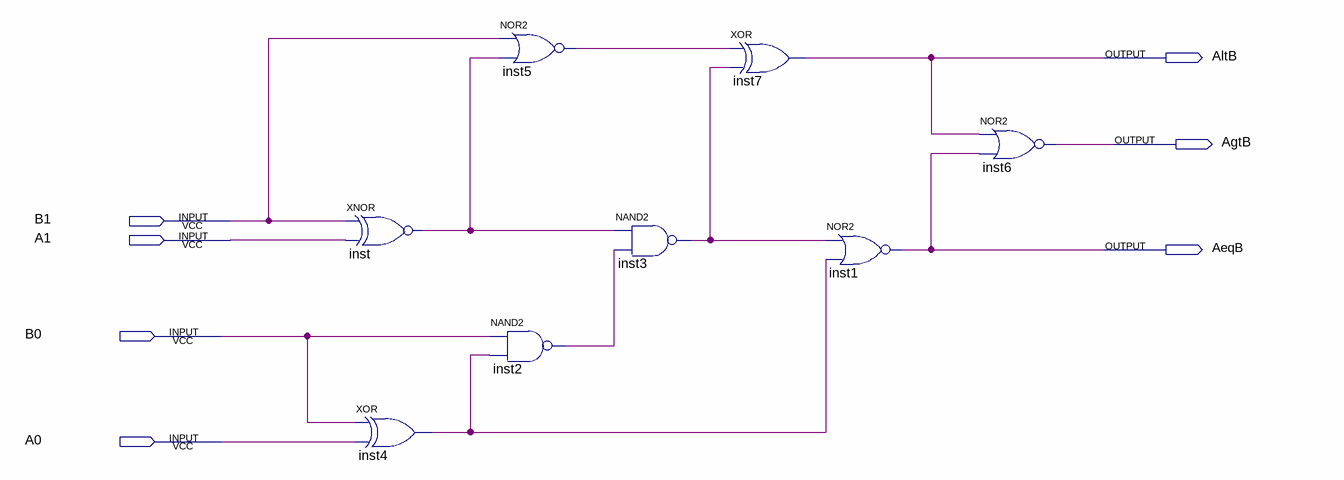
[diagram p0: schematic sheet]
// Quartus schematic Lab22.bdf as structural Verilog: 8 symbols, 7 pins
module Lab22 (
  input  B1,
  input  A1,
  input  B0,
  input  A0,
  output AltB,
  output AgtB,
  output AeqB
);

  wire inst2_out, inst3_out, inst4_out, inst5_out, inst_out;

  xnor inst (inst_out, B1, A1);
  xor inst4 (inst4_out, B0, A0);
  nor inst5 (inst5_out, B1, inst_out);
  nand inst2 (inst2_out, B0, inst4_out);
  nand inst3 (inst3_out, inst_out, inst2_out);
  xor inst7 (AltB, inst5_out, inst3_out);
  nor inst1 (AeqB, inst3_out, inst4_out);
  nor inst6 (AgtB, AltB, AeqB);
endmodule
